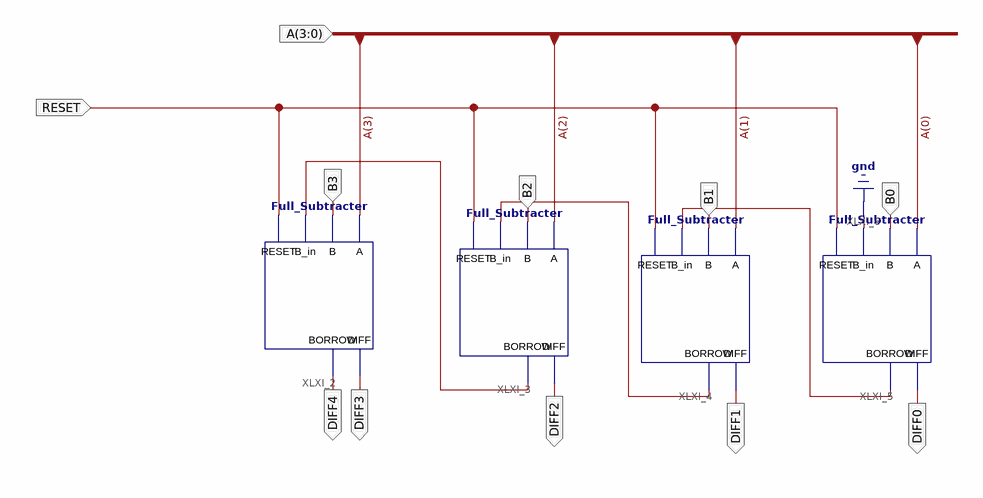
[diagram p0: schematic sheet 1]
// Xilinx ISE schematic Subtracter_4_Bit.sch (spartan6) as structural Verilog: 4 symbols, 11 ports
module Subtracter_4_Bit (
  input  RESET,
  input  B0,
  input  B1,
  input  B2,
  input  B3,
  input  [3:0] A,
  output DIFF3,
  output DIFF2,
  output DIFF1,
  output DIFF0,
  output DIFF4
);

  wire XLXN_3, XLXN_5, XLXN_7;

  Full_Subtracter XLXI_2 (.A(A[3]), .B(B3), .BORROW(DIFF4), .B_in(XLXN_7), .DIFF(DIFF3), .RESET(RESET));
  Full_Subtracter XLXI_3 (.A(A[2]), .B(B2), .BORROW(XLXN_7), .B_in(XLXN_5), .DIFF(DIFF2), .RESET(RESET));
  Full_Subtracter XLXI_4 (.A(A[1]), .B(B1), .BORROW(XLXN_5), .B_in(XLXN_3), .DIFF(DIFF1), .RESET(RESET));
  Full_Subtracter XLXI_5 (.A(A[0]), .B(B0), .BORROW(XLXN_3), .B_in(1'b0), .DIFF(DIFF0), .RESET(RESET));
endmodule
